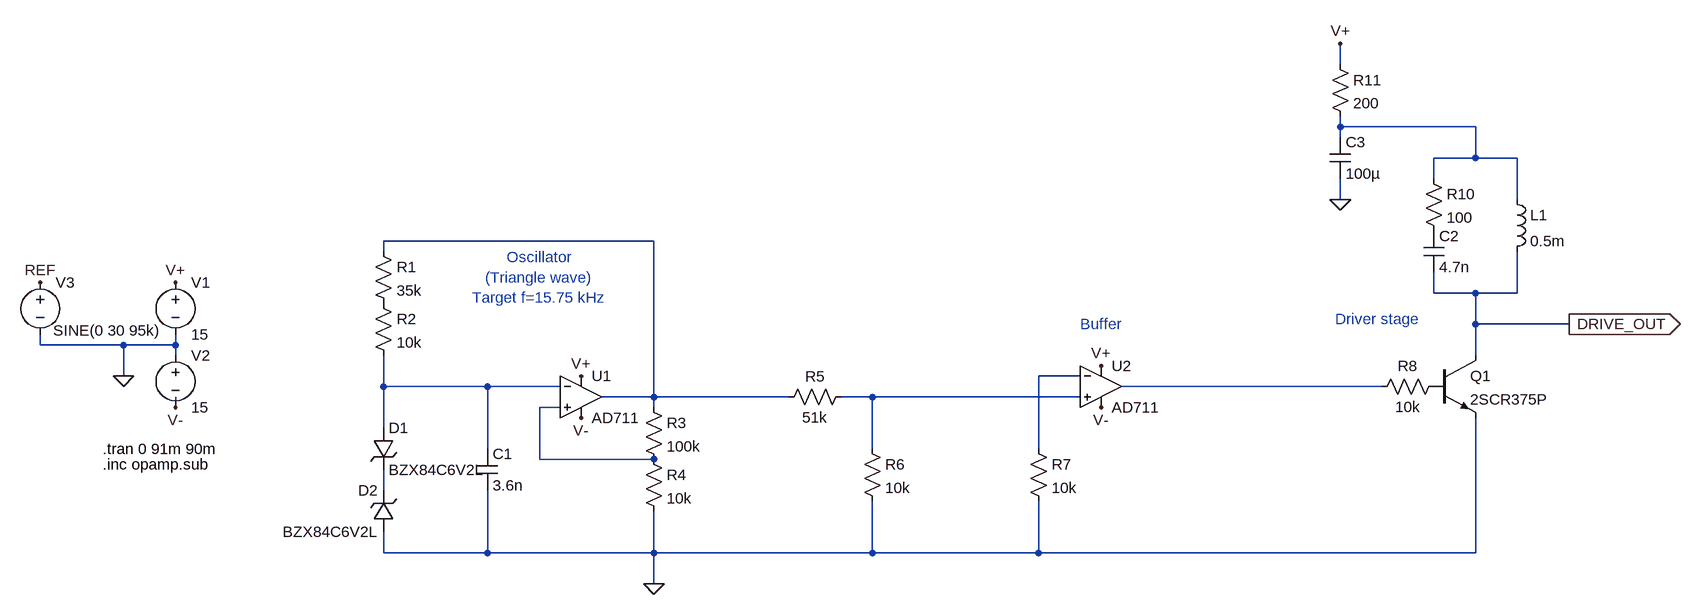
[diagram p0: schematic oscillator_simplified.asc]
oscillator_simplified.asc, the LTspice schematic file:
Version 4
SHEET 1 2340 680
WIRE 1792 -240 1792 -272
WIRE 1792 -144 1792 -160
WIRE 2000 -144 1792 -144
WIRE 1792 -128 1792 -144
WIRE 2000 -96 2000 -144
WIRE 2000 -96 1936 -96
WIRE 2064 -96 2000 -96
WIRE 1936 -64 1936 -96
WIRE 1792 -32 1792 -64
WIRE 2064 -32 2064 -96
WIRE 736 32 320 32
WIRE 320 48 320 32
WIRE 1936 112 1936 80
WIRE 2000 112 1936 112
WIRE 2064 112 2064 48
WIRE 2064 112 2000 112
WIRE 2000 160 2000 112
WIRE 2144 160 2000 160
WIRE -208 192 -208 176
WIRE -80 192 -208 192
WIRE 0 192 0 176
WIRE 0 192 -80 192
WIRE 0 208 0 192
WIRE 2000 208 2000 160
WIRE -80 240 -80 192
WIRE 1392 240 1328 240
WIRE 320 256 320 208
WIRE 480 256 320 256
WIRE 592 256 480 256
WIRE 1856 256 1456 256
WIRE 736 272 736 32
WIRE 736 272 656 272
WIRE 944 272 736 272
WIRE 1072 272 1024 272
WIRE 1392 272 1072 272
WIRE 0 288 0 272
WIRE 592 288 560 288
WIRE 736 288 736 272
WIRE 320 320 320 256
WIRE 480 352 480 256
WIRE 1072 352 1072 272
WIRE 1328 352 1328 240
WIRE 560 368 560 288
WIRE 736 368 560 368
WIRE 320 416 320 384
WIRE 320 512 320 480
WIRE 480 512 480 416
WIRE 480 512 320 512
WIRE 736 512 736 448
WIRE 736 512 480 512
WIRE 1072 512 1072 432
WIRE 1072 512 736 512
WIRE 1328 512 1328 432
WIRE 1328 512 1072 512
WIRE 2000 512 2000 304
WIRE 2000 512 1328 512
WIRE 736 560 736 512
FLAG 736 560 0
FLAG 0 96 V+
FLAG 0 288 V-
FLAG 624 240 V+
FLAG 1424 224 V+
FLAG 624 304 V-
FLAG 1424 288 V-
FLAG -80 240 0
FLAG 1792 -272 V+
FLAG -208 96 REF
FLAG 1792 -32 0
FLAG 2144 160 DRIVE_OUT
IOPIN 2144 160 Out
SYMBOL res 304 32 R0
SYMATTR InstName R1
SYMATTR Value 35k
SYMBOL res 304 112 R0
SYMATTR InstName R2
SYMATTR Value 10k
SYMBOL res 720 272 R0
SYMATTR InstName R3
SYMATTR Value 100k
SYMBOL res 720 352 R0
SYMATTR InstName R4
SYMATTR Value 10k
SYMBOL zener 304 320 R0
SYMATTR InstName D1
SYMATTR Value BZX84C6V2L
SYMBOL zener 336 480 R180
WINDOW 0 24 64 Left 2
WINDOW 3 24 0 Left 2
SYMATTR InstName D2
SYMATTR Value BZX84C6V2L
SYMBOL cap 464 352 R0
SYMATTR InstName C1
SYMATTR Value 3.6n
SYMBOL res 928 288 R270
WINDOW 0 32 56 VTop 2
WINDOW 3 0 56 VBottom 2
SYMATTR InstName R5
SYMATTR Value 51k
SYMBOL res 1056 336 R0
SYMATTR InstName R6
SYMATTR Value 10k
SYMBOL voltage 0 80 R0
WINDOW 123 0 0 Left 0
WINDOW 39 0 0 Left 0
SYMATTR InstName V1
SYMATTR Value 15
SYMBOL voltage 0 192 R0
WINDOW 123 0 0 Left 0
WINDOW 39 0 0 Left 0
SYMATTR InstName V2
SYMATTR Value 15
SYMBOL res 1312 336 R0
SYMATTR InstName R7
SYMATTR Value 10k
SYMBOL res 1952 240 R90
WINDOW 0 0 56 VBottom 2
WINDOW 3 32 56 VTop 2
SYMATTR InstName R8
SYMATTR Value 10k
SYMBOL res 1920 -80 R0
SYMATTR InstName R10
SYMATTR Value 100
SYMBOL cap 1920 16 R0
SYMATTR InstName C2
SYMATTR Value 4.7n
SYMBOL cap 1776 -128 R0
SYMATTR InstName C3
SYMATTR Value 100µ
SYMBOL res 1776 -256 R0
SYMATTR InstName R11
SYMATTR Value 200
SYMBOL npn 1936 208 R0
SYMATTR InstName Q1
SYMATTR Value 2SCR375P
SYMBOL ind 2048 -48 R0
SYMATTR InstName L1
SYMATTR Value 0.5m
SYMBOL Opamps\\AD711 624 208 R0
SYMATTR InstName U1
SYMBOL Opamps\\AD711 1424 192 R0
SYMATTR InstName U2
SYMBOL voltage -208 80 R0
WINDOW 3 20 90 Left 2
WINDOW 123 0 0 Left 0
WINDOW 39 0 0 Left 0
SYMATTR InstName V3
SYMATTR Value SINE(0 30 95k)
TEXT -112 352 Left 2 !.tran 0 91m 90m
TEXT -112 376 Left 2 !.inc opamp.sub
TEXT 560 88 Center 2 ;Oscillator\n(Triangle wave)\nTarget f=15.75 kHz
TEXT 1424 160 Center 2 ;Buffer
TEXT 1784 152 Left 2 ;Driver stage

The netlist it stands for:
* oscillator_simplified.asc
R1 N002 P001 35k
R2 P001 N004 10k
R3 N002 N007 100k
R4 N007 0 10k
D1 N004 N008 BZX84C6V2L
D2 0 N008 BZX84C6V2L
C1 N004 0 3.6n
R5 N002 N006 51k
R6 N006 0 10k
V1 V+ 0 15
V2 0 V- 15
R7 N003 0 10k
R8 P002 N005 10k
R10 N001 P003 100
C2 P003 DRIVE_OUT 4.7n
C3 N001 0 100µ
R11 V+ N001 200
Q1 DRIVE_OUT P002 0 0 2SCR375P
L1 N001 DRIVE_OUT 0.5m
XU1 N007 N004 V+ V- N002 AD712  ; AD711, pins In+ In- V+ V- OUT
XU2 N006 N003 V+ V- N005 AD712  ; AD711, pins In+ In- V+ V- OUT
V3 REF 0 SINE(0 30 95k)
.model D D
.lib standard.dio
.model NPN NPN
.model PNP PNP
.lib standard.bjt
.tran 0 91m 90m
.inc opamp.sub
* Oscillator
* (Triangle wave)
* Target f=15.75 kHz
* Buffer
* Driver stage
.lib ADI1.lib
.backanno
.end